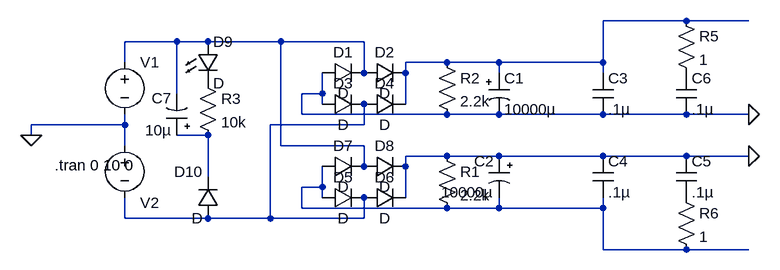
[diagram p0: schematic PowerSupply.asc]
PowerSupply.asc, the LTspice schematic file:
Version 4
SHEET 1 984 680
WIRE 768 0 640 0
WIRE 864 0 768 0
WIRE -16 32 -96 32
WIRE 32 32 -16 32
WIRE 144 32 32 32
WIRE 272 32 144 32
WIRE -96 64 -96 32
WIRE 400 64 336 64
WIRE 480 64 400 64
WIRE 640 64 640 0
WIRE 640 64 480 64
WIRE 272 80 272 32
WIRE 336 80 336 64
WIRE 480 80 480 64
WIRE 640 80 640 64
WIRE -16 112 -16 32
WIRE 208 112 208 80
WIRE 208 112 176 112
WIRE 208 128 208 112
WIRE 336 128 336 80
WIRE 176 144 176 112
WIRE 400 144 176 144
WIRE 480 144 400 144
WIRE 640 144 480 144
WIRE 768 144 640 144
WIRE 864 144 768 144
WIRE -96 160 -96 144
WIRE -96 160 -240 160
WIRE 272 160 272 128
WIRE 272 160 128 160
WIRE -240 176 -240 160
WIRE 32 176 -16 176
WIRE -96 192 -96 160
WIRE 144 192 144 32
WIRE 272 192 144 192
WIRE 400 208 336 208
WIRE 480 208 400 208
WIRE 640 208 480 208
WIRE 768 208 640 208
WIRE 864 208 768 208
WIRE 272 224 272 192
WIRE 336 224 336 208
WIRE 32 240 32 176
WIRE 208 256 208 224
WIRE 208 256 176 256
WIRE 208 272 208 256
WIRE 336 272 336 224
WIRE 176 288 176 256
WIRE 400 288 176 288
WIRE 480 288 480 272
WIRE 480 288 400 288
WIRE 640 288 640 272
WIRE 640 288 480 288
WIRE -96 304 -96 272
WIRE 32 304 -96 304
WIRE 128 304 128 160
WIRE 128 304 32 304
WIRE 272 304 272 272
WIRE 272 304 128 304
WIRE 640 352 640 288
WIRE 768 352 640 352
WIRE 864 352 768 352
FLAG -240 176 0
FLAG 864 144 0
FLAG 864 208 0
SYMBOL voltage -96 48 R0
WINDOW 3 24 104 Invisible 0
WINDOW 123 0 0 Left 0
WINDOW 39 0 0 Left 0
SYMATTR InstName V1
SYMATTR Value SINE(0 25.5 60)
SYMBOL voltage -96 176 R0
WINDOW 0 24 104 Left 0
WINDOW 3 24 16 Invisible 0
WINDOW 123 0 0 Left 0
WINDOW 39 0 0 Left 0
SYMATTR InstName V2
SYMATTR Value SINE(0 25.5 60)
SYMBOL diode 208 96 R270
WINDOW 0 32 32 VTop 0
WINDOW 3 0 32 VBottom 0
SYMATTR InstName D1
SYMBOL diode 272 96 R270
WINDOW 0 32 32 VTop 0
WINDOW 3 0 32 VBottom 0
SYMATTR InstName D2
SYMBOL diode 208 144 R270
WINDOW 0 32 32 VTop 0
WINDOW 3 0 32 VBottom 0
SYMATTR InstName D3
SYMBOL diode 272 144 R270
WINDOW 0 32 32 VTop 0
WINDOW 3 0 32 VBottom 0
SYMATTR InstName D4
SYMBOL diode 208 288 R270
WINDOW 0 32 32 VTop 0
WINDOW 3 0 32 VBottom 0
SYMATTR InstName D5
SYMBOL diode 272 288 R270
WINDOW 0 32 32 VTop 0
WINDOW 3 0 32 VBottom 0
SYMATTR InstName D6
SYMBOL diode 208 240 R270
WINDOW 0 32 32 VTop 0
WINDOW 3 0 32 VBottom 0
SYMATTR InstName D7
SYMBOL diode 272 240 R270
WINDOW 0 32 32 VTop 0
WINDOW 3 0 32 VBottom 0
SYMATTR InstName D8
SYMBOL res 384 192 R0
SYMATTR InstName R1
SYMATTR Value 2.2k
SYMATTR SpiceLine pwr=2
SYMBOL res 384 48 R0
SYMATTR InstName R2
SYMATTR Value 2.2k
SYMATTR SpiceLine pwr=2
SYMBOL polcap 464 80 R0
SYMATTR InstName C1
SYMATTR Value 10000µ
SYMBOL polcap 496 208 M0
SYMATTR InstName C2
SYMATTR Value 10000µ
SYMBOL cap 624 80 R0
SYMATTR InstName C3
SYMATTR Value .1µ
SYMBOL cap 624 208 R0
SYMATTR InstName C4
SYMATTR Value .1µ
SYMBOL cap 752 208 R0
SYMATTR InstName C5
SYMATTR Value .1µ
SYMBOL cap 752 80 R0
SYMATTR InstName C6
SYMATTR Value .1µ
SYMBOL res 752 -16 R0
SYMATTR InstName R5
SYMATTR Value 1
SYMATTR SpiceLine pwr=2
SYMBOL res 752 256 R0
SYMATTR InstName R6
SYMATTR Value 1
SYMATTR SpiceLine pwr=2
SYMBOL LED 16 32 R0
SYMATTR InstName D9
SYMBOL res 16 80 R0
SYMATTR InstName R3
SYMATTR Value 10k
SYMBOL polcap 0 176 R180
WINDOW 0 24 57 Left 0
WINDOW 3 24 8 Left 0
SYMATTR InstName C7
SYMATTR Value 10µ
SYMATTR SpiceLine V=50
SYMBOL diode 48 304 R180
WINDOW 0 24 72 Left 0
WINDOW 3 24 0 Left 0
SYMATTR InstName D10
TEXT -204 222 Left 0 !.tran 0 10 0

The netlist it stands for:
* PowerSupply.asc
V1 N002 0 SINE(0 25.5 60)
V2 0 N003 SINE(0 25.5 60)
D1 0 N002 D
D2 N002 N001 D
D3 0 N003 D
D4 N003 N001 D
D5 N005 N003 D
D6 N003 0 D
D7 N005 N002 D
D8 N002 0 D
R1 0 N005 2.2k pwr=2
R2 N001 0 2.2k pwr=2
C1 N001 0 10000µ
C2 0 N005 10000µ
C3 N001 0 .1µ
C4 0 N005 .1µ
C5 0 P001 .1µ
C6 P002 0 .1µ
R5 N001 P002 1 pwr=2
R6 P001 N005 1 pwr=2
D9 N002 P003 D
R3 P003 N004 10k
C7 N004 N002 10µ V=50
D10 N003 N004 D
.model D D
.lib standard.dio
.tran 0 10 0
.backanno
.end